# Altium schematic sheet power.SchDoc: Power Management
size A4; Organization: heig-vd; Address1: heig-vd; Address2: Route de Cheseaux 1; Address3: 1401 Yverdon-les-Bains; Address4: Suisse; DocumentNumber: 9; Revision: 1.1; SheetNumber: 9; SheetTotal: 12
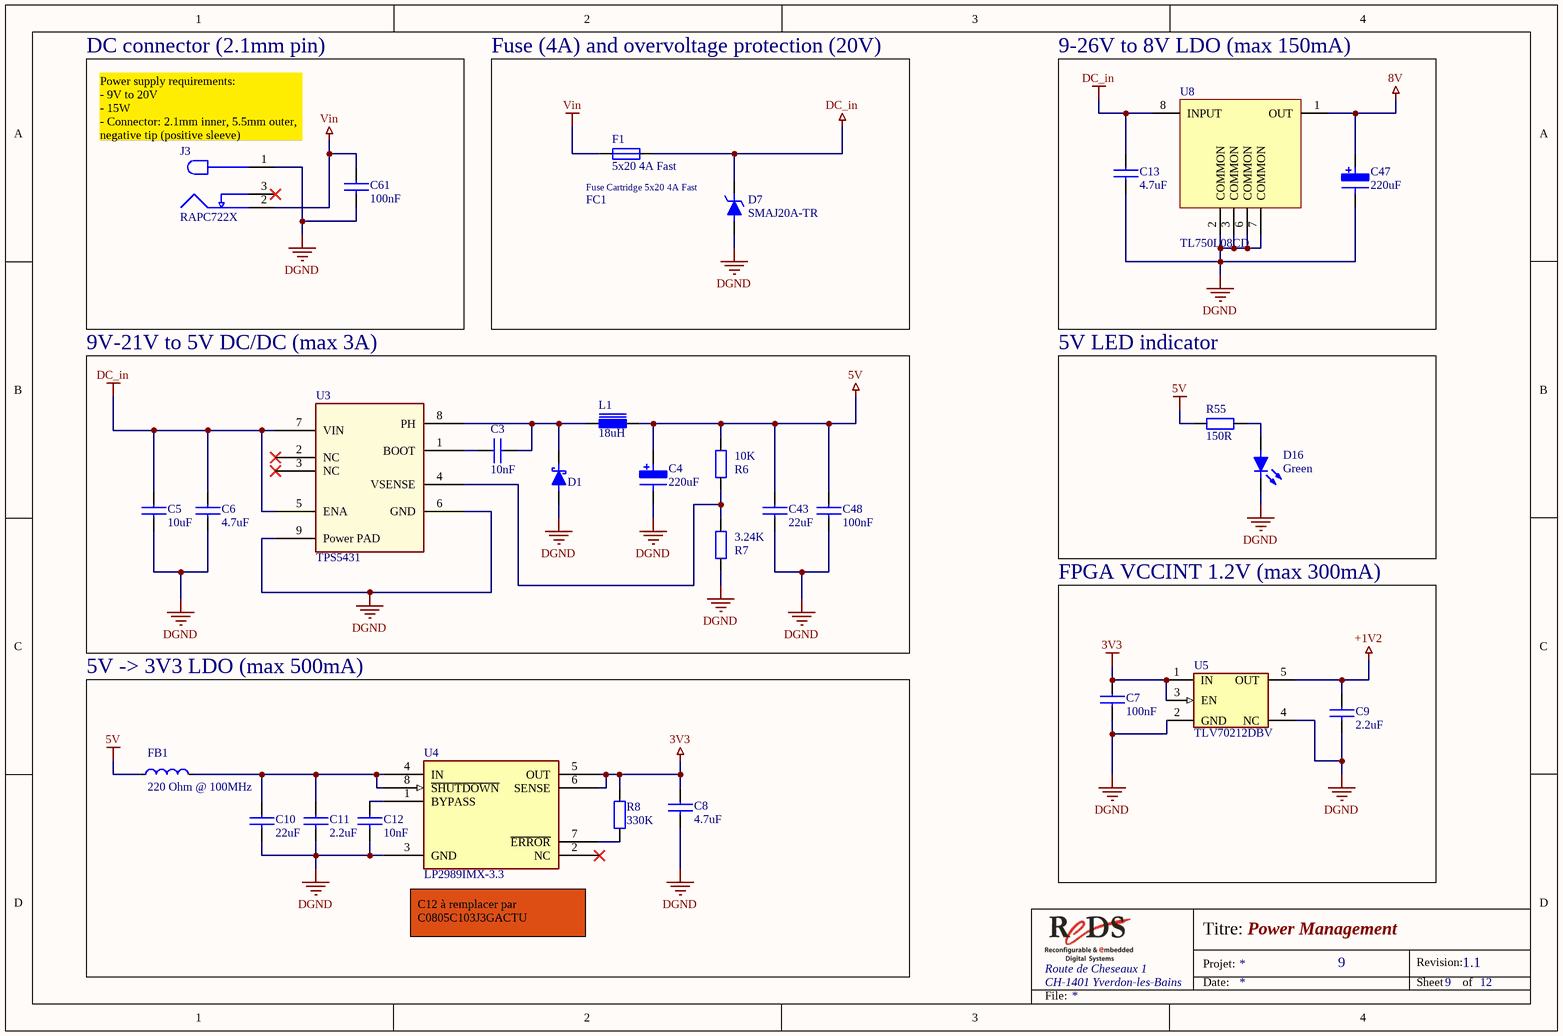
[diagram p0: power.SchDoc]

## Parts
C3  10nF  [SM/C_0603]
C4  220uF  [SM/CT_7343_12_D]
C5  10uF  [SM/C_1206]
C6  4.7uF  [SM/C_1210]
C7  100nF  [SM/C_0603]
C8  4.7uF  [SM/C_0805]
C9  2.2uF  [SM/C_0805]
C10  22uF  [SM/C_0805]
C11  2.2uF  [SM/C_0805]
C12  10nF  [SM/C_0805]
C13  4.7uF  [SM/C_1210]
C43  22uF  [SM/C_0805]
C47  220uF  [SM/CT_7343_12_D]
C48  100nF  [SM/C_0603]
C61  100nF  [SM/C_0805]
D1  B340A  [SM/D_DO214-AC (SMA)]  (value not drawn)
D7  SMAJ20A-TR  [SM/D_DO214-AC (SMA)]
D16  value Green  [S_1101F_GREEN]  (hidden comment: Led)
F1  value 5x20 4A Fast  [5x20 LittelFuse 111 50x]  (hidden comment: Fuse)
FB1  value 220 Ohm @ 100MHz  [SM/L_0805]  (hidden comment: LM21PG221SN1D)
FC1  Fuse Cartridge 5x20 4A Fast  (value not drawn)  (mechanical)
J3  RAPC722X  [RAPC722X]
L1  18uH  [BOURNS_1260]
R6  10K  [SM/R_0603]
R7  3.24K  [SM/R_0603]
R8  330K  [SM/R_0603]
R55  150R  [SM/R_0603]
U3  TPS5431  [SOIC-8 - N - Power Pad]
U4  LP2989IMX-3.3  [SOIC-8 - N]
U5  TLV70212DBV  [SOT23-5]
U8  TL750L08CD  [SOIC-8 - N]

## Blocks framed on the sheet
DC connector (2.1mm pin): C61 J3
Fuse (4A) and overvoltage protection (20V): D7 F1 FC1
9-26V to 8V LDO (max 150mA): C13 C47 U8
9V-21V to 5V DC/DC (max 3A): C3-C6 C43 C48 D1 L1 R6 R7 U3
5V LED indicator: D16 R55
FPGA VCCINT 1.2V (max 300mA): C7 C9 U5
5V -> 3V3 LDO (max 500mA): C8 C10-C12 FB1 R8 U4

## Nets
3V3: C7.1 C8.1 R8.1 U4.5(OUT) U4.6(SENSE) U5.1(IN) U5.3(EN)
5V: C4.1 C43.1 C48.1 FB1.1 L1.2 R6.1 R55.1
8V: C47.1 U8.1(OUT)
+1V2: C9.1 U5.5(OUT)
DC_in: C5.1 C6.1 C13.1 D7.2(C) F1.2 U3.5(ENA) U3.7(VIN) U8.8(INPUT)
DGND: C4.2 C5.2 C6.2 C7.2 C8.2 C9.2 C10.2 C11.2 C12.2 C13.2 C43.2 C47.2 C48.2 C61.2 D1.1(A) D7.1(A) D16.1(C) J3.1 R7.1 U3.6(GND) U3.9(Power_PAD) U4.3(GND) U5.2(GND) U5.4(NC) U8.2(COMMON) U8.3(COMMON) U8.6(COMMON) U8.7(COMMON)
Vin: C61.1 F1.1 J3.2
NetC3_1: C3.1 U3.1(BOOT)
NetC3_2: C3.2 D1.2(C) L1.1 U3.8(PH)
NetC10_1: C10.1 C11.1 FB1.2 U4.4(IN) U4.8(~{SHUTDOWN})
NetC12_1: C12.1 U4.1(BYPASS)
NetD16_2: D16.2(A) R55.2
NetR6_2: R6.2 R7.2 U3.4(VSENSE)
NetR8_2: R8.2 U4.7(~{ERROR})

Not connected (* = marked no-connect by the designer): J3 3*; U3 2(NC)* 3(NC)*; U4 2(NC)*; U8 4(NC) 5(NC)

## Notes on the sheet
- (near J3) Power supply requirements:
  - 9V to 20V
  - 15W
  - Connector: 2.1mm inner, 5.5mm outer, negative tip (positive sleeve)
- (near U4) C12 à remplacer par C0805C103J3GACTU
- Route de Cheseaux 1
- CH-1401 Yverdon-les-Bains
- Titre:
- Date:
- Projet:
- Revision:
- Sheet
- of
- File:

## Library data of the parts
C3 = 183: Ceramic multi-layer; Manufacturer: AVX; Manufacturer P/N: 06035C103KAZ2A; ID: 183; Voltage: 50V; Tolerance: ±10%; Value: 10nF; Component Type: Capacitor, non-polarized; Supplier 1: Farnell; Supplier Part Number 1: 7569548; RoHS Compliant: True
C4 C47 = CapPol: Tantalum Polymer 40mOhm ESR; Manufacturer: Panasonic; Manufacturer P/N: 10TPB220ML; Voltage: 10V; Tolerance: ±20%; Component Type: Capacitor, polarized; RoHS Compliant: True; Supplier 1: Digi-Key; Supplier Part Number 1: P16448CT-ND; Value: 220uF
C5 = 1985: Chip Monolithic Ceramic Capacitor; Manufacturer: muRata; Manufacturer P/N: GRM31CR6YA106KA12L; ID: 1985; Voltage: 35V; Tolerance: ±10%; Value: 10uF; Component Type: Capacitor, non-polarized; Supplier 1: Farnell; Supplier Part Number 1: 1797011; Supplier 2: Digi-Key; Supplier Part Number 2: 490-5524-2-ND; RoHS Compliant: True
C6 C13 = 2228: CONDENSATEUR 4.7UF 50V X7R 1210; Manufacturer: KEMET; Manufacturer P/N: C1210C475K5RACTU; ID: 2228; Tolerance: ± 10%; Value: 4.7uF; Component Type: Capacitor, non-polarized; Voltage: 50V; Supplier 1: Farnell; Supplier Part Number 1: 1358511; Supplier 2: Mouser; Supplier Part Number 2: 80-C1210C475K5R; RoHS Compliant: True; ComponentLink1Description: Datasheet; ComponentLink1URL: http://capacitoredge.kemet.com/capedge2/intellispec.jsp?pn=C1210C475K5RACTU&displayPN=C1210C475K5RACTU; ComponentLink2Description: Supplier; ComponentLink2URL: http://www.mouser.ch/ProductDetail/Kemet/C1210C475K5RACTU/?qs=sGAEpiMZZMs0AnBnWHyRQHl0P4nCjF4rcGD3QL%252bxV3g%3d
C7 C48 = 182: Ceramic multi-layer; Manufacturer: AVX; Manufacturer P/N: 0603YC104KAZ2A; ID: 182; Voltage: 16V; Tolerance: ±10%; Value: 100nF; Component Type: Capacitor, non-polarized; Supplier 1: Farnell; Supplier Part Number 1: 7569556; RoHS Compliant: True
C8 = 405: Ceramic multi-layer; Manufacturer: muRata; Manufacturer P/N: GRM219R60J475KE19D; ID: 405; Voltage: 6.3V; Tolerance: ±10%; Value: 4.7uF; Component Type: Capacitor, non-polarized; Supplier 1: Farnell; Supplier Part Number 1: 9522999; RoHS Compliant: True
C9 C11 = 397: Ceramic Chip Capacitor; Manufacturer: Kemet; Manufacturer P/N: C0805C225K4RAC; ID: 397; Voltage: 16V; Tolerance: ±10%; Value: 2.2uF; Component Type: Capacitor, non-polarized; Supplier 1: Farnell; Supplier Part Number 1: 1288262; RoHS Compliant: True
C10 C43 = 398: Ceramic multi-layer; Manufacturer: Kemet; Manufacturer P/N: C0805C226M9PAC7800; ID: 398; Voltage: 6.3; Tolerance: ±20%; Value: 22uF; Component Type: Capacitor, non-polarized; Supplier 1: Farnell; Supplier Part Number 1: 1108326; RoHS Compliant: True
C12 = 2064: Ceramic Chip Capacitor; Manufacturer: Kemet; Manufacturer P/N: C0805C103K5RAC; ID: 2064; Voltage: 50V; Tolerance: ±10%; Value: 10nF; Component Type: Capacitor, non-polarized; Supplier 1: Digi-Key; Supplier Part Number 1: C0805C103K5RACTR-ND; Supplier 2: Mouser; Supplier Part Number 2: 80-C0805C103K5RAC; RoHS Compliant: True; ComponentLink1Description: Datasheet; ComponentLink1URL: #http://www.kemet.com/kemet/web/homepage/kechome.nsf/vapubfiles/KEM_C1002_X7R_SMD.pdf/$file/KEM_C1002_X7R_SMD.pdf#; ComponentLink2Description: Supplier; ComponentLink2URL: #http://www.digikey.fr/scripts/dksearch/dksus.dll?vendor=0&keywords=C0805C103K5RACTR-ND#
C61 = 395: Ceramic Chip Capacitor; Manufacturer: Kemet; Manufacturer P/N: C0805C104K5RAC7800; ID: 395; Voltage: 50V; Tolerance: ±10%; Value: 100nF; Component Type: Capacitor, non-polarized; Supplier 1: Farnell; Supplier Part Number 1: 1414664; RoHS Compliant: False
D1 = Diode Schottky B340A: DIODE SCHOTTKY 30V 3A SMA; Supplier 1: Newark; Supplier 2: Mouser; Supplier 3: Allied; Supplier 4: Arrow; Supplier 5: Farnell; Supplier 6: Digi-Key; Supplier 7: Digi-Key; Supplier Part Number 1: 12T1465; Supplier Part Number 2: 621-B340A-F; Supplier Part Number 3: 70437566; Supplier Part Number 5: 1843668; Supplier Part Number 6: B340A-FDICT-ND; Supplier Part Number 7: B340A-FDIDKR-ND
D7 = 565: Transil™ diode; Manufacturer: STMicroelectronics; ID: 565; Component Type: Diode TVS; Manufacturer P/N: SMAJ20A-TR; Value: SMAJ20A-TR; RoHS Compliant: False
D16 = Led RA Green: SMT LED, 1001F Series, Single Color Right Angle Type (3.0 X 2.0 mm); Manufacturer: Kingbright; Manufacturer P/N: APA3010ZGC-GX; Voltage: 3.3 V; Component Type: Led; RoHS Compliant: True; Supplier 1: Mouser; Supplier 2: Digi-Key; Supplier Part Number 1: 604-APA3010ZGC-GX; Supplier Part Number 2: 754-1575-1-ND
F1 = 2193: Porte-fusibles, OG ø 5 x 20 mm OG; Manufacturer: Schurter; Manufacturer P/N: 0751.0052; ID: 2193; Component Type: Porte_Fusible; Supplier 1: Distrelec; Supplier Part Number 1: 271015; Supplier 2: Mouser; Supplier Part Number 2: 693-0751.0052; RoHS Compliant: True
FB1 = 1991: PERLE DE FERRITE 0805. 220 OHMS/100MHz; Manufacturer: Murata; ID: 1991; Tolerance: ± 25%; Component Type: Ferrite; Manufacturer P/N: LM21PG221SN1D; Supplier 1: Digi-Key; Supplier Part Number 1: 490-1054-1-ND; RoHS Compliant: True
FC1 = Fuse-Cartridge: Cartridge Fuses FSF 5X20 250V 4A; Manufacturer: Schurter; Manufacturer P/N: 0034.1522; Supplier 1: Mouser; Supplier 2: Allied; Supplier 3: Digi-Key; Supplier Part Number 1: 693-0034.1522; Supplier Part Number 2: 70159906; Supplier Part Number 3: 486-1239-ND
J3 = DC plug: DC Power Connectors PCB 2.1MM; Manufacturer: SwitchCraft; Manufacturer P/N: RAPC722X; RoHS Compliant: True; Value: RAPC722X; Supplier 1: Digi-Key; Supplier 2: Allied; Supplier 3: Arrow; Supplier 4: Mouser; Supplier 5: Farnell; Supplier 6: Newark; Supplier Part Number 1: SC1313-ND; Supplier Part Number 2: 70214249; Supplier Part Number 3: blYXMuP4ttz343UuLrm15RbyFWZhgxSi-pvmLfeRSPM; Supplier Part Number 4: 502-RAPC722X; Supplier Part Number 5: 1654842; Supplier Part Number 6: 65K7786
L1 = Inductor: INDUCTOR POWER 18UH 4.2A SMD; Manufacturer: Bourns; Manufacturer P/N: SRR1260-180M; Supplier 1: Arrow; Supplier 2: Farnell; Supplier 3: Digi-Key; Supplier 4: Newark; Supplier 5: Mouser; Supplier Part Number 1: TL_AR8erWPXUZP3N6toZ0N0v_Pdy6Q30xQll4OGV_E0; Supplier Part Number 2: 1852891; Supplier Part Number 3: SRR1260-180MDKR-ND; Supplier Part Number 4: 02J3131; Supplier Part Number 5: 652-SRR1260-180M
R6 = 133: Résistance 0603 63mW 1% 10K; Manufacturer: Multicomp; Manufacturer P/N: MC 0.036mW 0603 1% 10K; ID: 133; Voltage: 50V; Value: 10K; Component Type: Résistance; Power: 63mW; Tolerance: 1%; Supplier 1: Farnell; Supplier Part Number 1: 9330399; RoHS Compliant: False
R7 = Res: Résistance 0603 100mW 1% 3.24K; Manufacturer: Panasonic; Manufacturer P/N: ERJ-3EKF3241V; Voltage: 75V; Value: 3.24K; Component Type: Résistance; Power: 100mW; Tolerance: 1%; RoHS Compliant: True; Supplier 1: Mouser; Supplier 2: Allied; Supplier 3: Digi-Key; Supplier 4: Arrow; Supplier 5: Newark; Supplier Part Number 1: 667-ERJ-3EKF3241V; Supplier Part Number 2: 70265773; Supplier Part Number 3: P3.24KHCT-ND; Supplier Part Number 5: 65T8426
R8 = 169: Résistance 0603 63mW 1% 330K; Manufacturer: Multicomp; Manufacturer P/N: MC 0.036mW 0603 1% 330K; ID: 169; Voltage: 50V; Value: 330K; Component Type: Résistance; Power: 63mW; Tolerance: 1%; Supplier 1: Farnell; Supplier Part Number 1: 9331042; RoHS Compliant: False
R55 = 89: Résistance 0603 63mW 1% 150R; Manufacturer: Multicomp; Manufacturer P/N: MC 0.036mW 0603 1% 150R; ID: 89; Voltage: 50V; Value: 150R; Component Type: Résistance; Power: 63mW; Tolerance: 1%; Supplier 1: Farnell; Supplier Part Number 1: 9330593; RoHS Compliant: False
U3 = TPS5431: IC REG BUCK ADJ 3A 8SO; Manufacturer: Texas Instruments; Manufacturer P/N: TPS5431DDAR; ID: 2042; Pitch: 1.27mm; Body: 5x4x1.75mm; Component Type: IC; Category: ICs analogiques linéaires; Package Type: SOIC-8; Value: TPS5431; RoHS Compliant: True; Supplier 1: Arrow; Supplier 2: Mouser; Supplier 3: Digi-Key; Supplier Part Number 1: d0f3wp0FcCwsu7PyZ1UsheiGmPJnpAWalhsyOBe_tJk; Supplier Part Number 2: 595-TPS5431DDAR; Supplier Part Number 3: 296-41750-1-ND
U4 = 2183: LP2989 500mA Linear Voltage Regulator for Digital Applications; Manufacturer: Texas Instruments; Manufacturer P/N: LP2989IMX-3.3/NOPB; ID: 2183; Pitch: 1.27mm; Body: 5x4x1.75mm; Value: LP2989MX-3.3; Component Type: IC; Category: ICs analogiques linéaires; Package Type: SOIC-8; Supplier 1: Digi-Key; Supplier Part Number 1: LP2989IMX-3.3/NOPBCT-ND; Supplier 2: Mouser; Supplier Part Number 2: 926-LP2989IMX33NOPB; RoHS Compliant: True; ComponentLink1Description: Datasheet; ComponentLink1URL: http://www.ti.com/lit/ds/symlink/lp2989.pdf; ComponentLink2Description: Supplier; ComponentLink2URL: http://www.mouser.ch/ProductDetail/Texas-Instruments/LP2989IMX-33-NOPB/?qs=sGAEpiMZZMsGz1a6aV8DcBojudwDyMGaqCTSHgR7uDw%3d
U5 = TLV70212: Régulateur LDO +1.2V, 300mA; Manufacturer: Texas Instruments; Pitch: 0.65mm; Component Type: IC; Manufacturer P/N: TLV70212DBV; Category: ICs analogiques linéaires; Package Type: SOT23-5; Value: TLV70212DBV; RoHS Compliant: True; Supplier 1: Mouser; Supplier 2: Digi-Key; Supplier 3: Farnell; Supplier 4: Arrow; Supplier Part Number 1: 595-TLV70212DBVR; Supplier Part Number 2: 296-29583-1-ND; Supplier Part Number 3: 2455686; Supplier Part Number 4: m4UZFwQuYpTafyOZsC6RDYHVEIEFGGaLKVC4VyXQD_U
U8 = TL750L08CD: Régulateur LDO +8.0V, 150mA; Manufacturer: Texas Instruments; Pitch: 1.27mm; Component Type: IC; Manufacturer P/N: TL750L08CD; Category: ICs analogiques linéaires; Package Type: SOIC; Value: TL750L08CD; RoHS Compliant: True; Supplier 1: Arrow; Supplier 2: Digi-Key; Supplier 3: Mouser; Supplier Part Number 1: ptwpRgI95fu-x3X5RzoczI1OkBIGrgz1E6z2s0uSeOY; Supplier Part Number 2: 296-8004-5-ND; Supplier Part Number 3: 595-TL750L08CDR